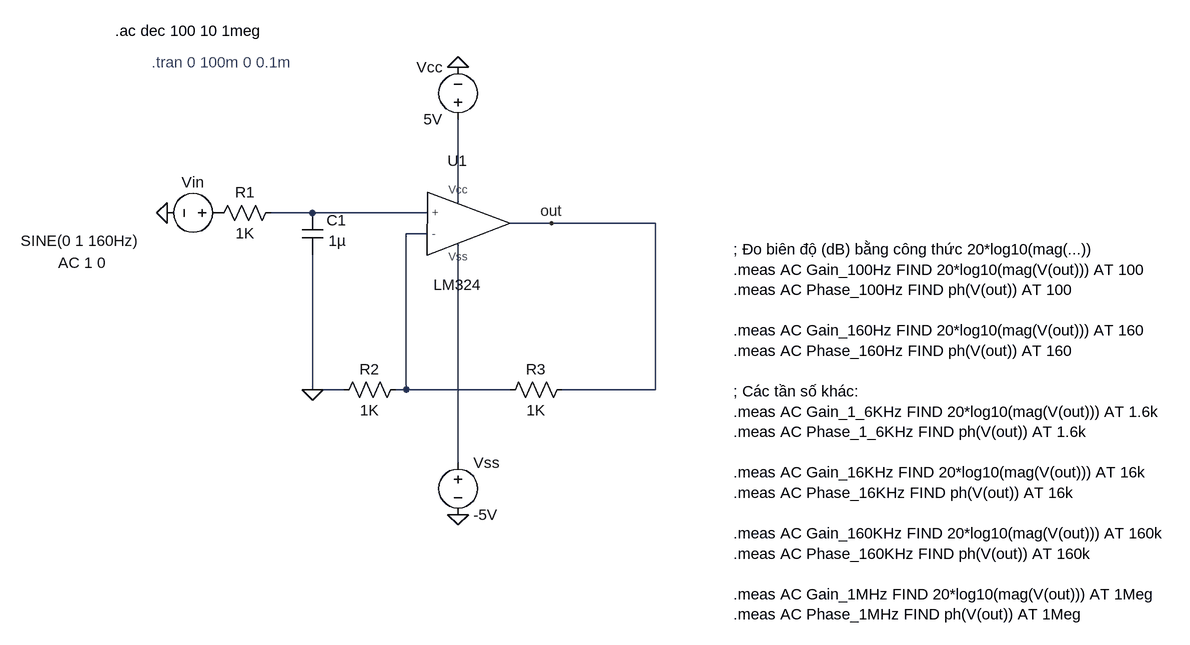
[diagram p0: schematic BAI 4 THUC HANH 1.asc]
BAI 4 THUC HANH 1.asc, the LTspice schematic file:
Version 4.1
SHEET 1 1356 720
WIRE 208 128 208 0
WIRE -16 144 -80 144
WIRE 160 144 -16 144
WIRE 352 160 288 160
WIRE 512 160 352 160
WIRE 160 176 128 176
WIRE -16 416 -16 208
WIRE 32 416 -16 416
WIRE 128 416 128 176
WIRE 128 416 112 416
WIRE 288 416 128 416
WIRE 512 416 512 160
WIRE 512 416 368 416
WIRE 208 528 208 192
FLAG 208 -80 0
FLAG -240 144 0
FLAG -16 416 0
FLAG 352 160 out
FLAG 208 608 0
SYMBOL LM324 208 160 R0
SYMATTR InstName U1
SYMBOL voltage 208 16 R180
WINDOW 0 24 96 Left 2
WINDOW 3 24 16 Left 2
SYMATTR InstName Vcc
SYMATTR Value 5V
SYMBOL voltage -144 144 R90
WINDOW 0 -32 56 VBottom 2
WINDOW 3 27 230 VTop 2
WINDOW 123 61 227 VTop 2
WINDOW 39 0 0 Left 0
SYMATTR InstName Vin
SYMATTR Value SINE(0 1 160Hz)
SYMATTR Value2 AC 1 0
SYMBOL res -176 160 R270
WINDOW 0 32 56 VTop 2
WINDOW 3 0 56 VBottom 2
SYMATTR InstName R1
SYMATTR Value 1K
SYMBOL cap 0 208 R180
WINDOW 0 -36 53 Left 2
WINDOW 3 -36 21 Left 2
SYMATTR InstName C1
SYMATTR Value 1µ
SYMBOL res 128 400 R90
WINDOW 0 0 56 VBottom 2
WINDOW 3 32 56 VTop 2
SYMATTR InstName R2
SYMATTR Value 1K
SYMBOL res 384 400 R90
WINDOW 0 0 56 VBottom 2
WINDOW 3 32 56 VTop 2
SYMATTR InstName R3
SYMATTR Value 1K
SYMBOL voltage 208 512 R0
SYMATTR InstName Vss
SYMATTR Value -5V
TEXT -320 -136 Left 2 !.ac dec 100 10 1meg
TEXT -264 -88 Left 2 ;.tran 0 100m 0 0.1m
TEXT 632 200 Left 2 !; Đo biên độ (dB) bằng công thức 20*log10(mag(...))\n.meas AC Gain_100Hz FIND 20*log10(mag(V(out))) AT 100\n.meas AC Phase_100Hz FIND ph(V(out)) AT 100\n \n.meas AC Gain_160Hz FIND 20*log10(mag(V(out))) AT 160\n.meas AC Phase_160Hz FIND ph(V(out)) AT 160\n \n; Các tần số khác:\n.meas AC Gain_1_6KHz FIND 20*log10(mag(V(out))) AT 1.6k\n.meas AC Phase_1_6KHz FIND ph(V(out)) AT 1.6k\n \n.meas AC Gain_16KHz FIND 20*log10(mag(V(out))) AT 16k\n.meas AC Phase_16KHz FIND ph(V(out)) AT 16k\n \n.meas AC Gain_160KHz FIND 20*log10(mag(V(out))) AT 160k\n.meas AC Phase_160KHz FIND ph(V(out)) AT 160k\n \n.meas AC Gain_1MHz FIND 20*log10(mag(V(out))) AT 1Meg\n.meas AC Phase_1MHz FIND ph(V(out)) AT 1Meg

The netlist it stands for:
* BAI 4 THUC HANH 1.asc
X§U1 N002 N003 N001 N004 out LM324  ; pins + - Vcc Vss ?
Vcc N001 0 5V
Vin P001 0 SINE(0 1 160Hz) AC 1 0
R1 P001 N002 1K
C1 0 N002 1µ
R2 N003 0 1K
R3 out N003 1K
Vss N004 0 -5V
.ac dec 100 10 1meg
* .tran 0 100m 0 0.1m
; Đo biên độ (dB) bằng công thức 20*log10(mag(...))
.meas AC Gain_100Hz FIND 20*log10(mag(V(out))) AT 100
.meas AC Phase_100Hz FIND ph(V(out)) AT 100
.meas AC Gain_160Hz FIND 20*log10(mag(V(out))) AT 160
.meas AC Phase_160Hz FIND ph(V(out)) AT 160
; Các tần số khác:
.meas AC Gain_1_6KHz FIND 20*log10(mag(V(out))) AT 1.6k
.meas AC Phase_1_6KHz FIND ph(V(out)) AT 1.6k
.meas AC Gain_16KHz FIND 20*log10(mag(V(out))) AT 16k
.meas AC Phase_16KHz FIND ph(V(out)) AT 16k
.meas AC Gain_160KHz FIND 20*log10(mag(V(out))) AT 160k
.meas AC Phase_160KHz FIND ph(V(out)) AT 160k
.meas AC Gain_1MHz FIND 20*log10(mag(V(out))) AT 1Meg
.meas AC Phase_1MHz FIND ph(V(out)) AT 1Meg
.lib E:\ThiThucHanhCoHa\CoHa\LM324.cir
.backanno
.end